# EAGLE schematic MAIN_FM (EAGLE 5.11)

## Sheet 1 of 6
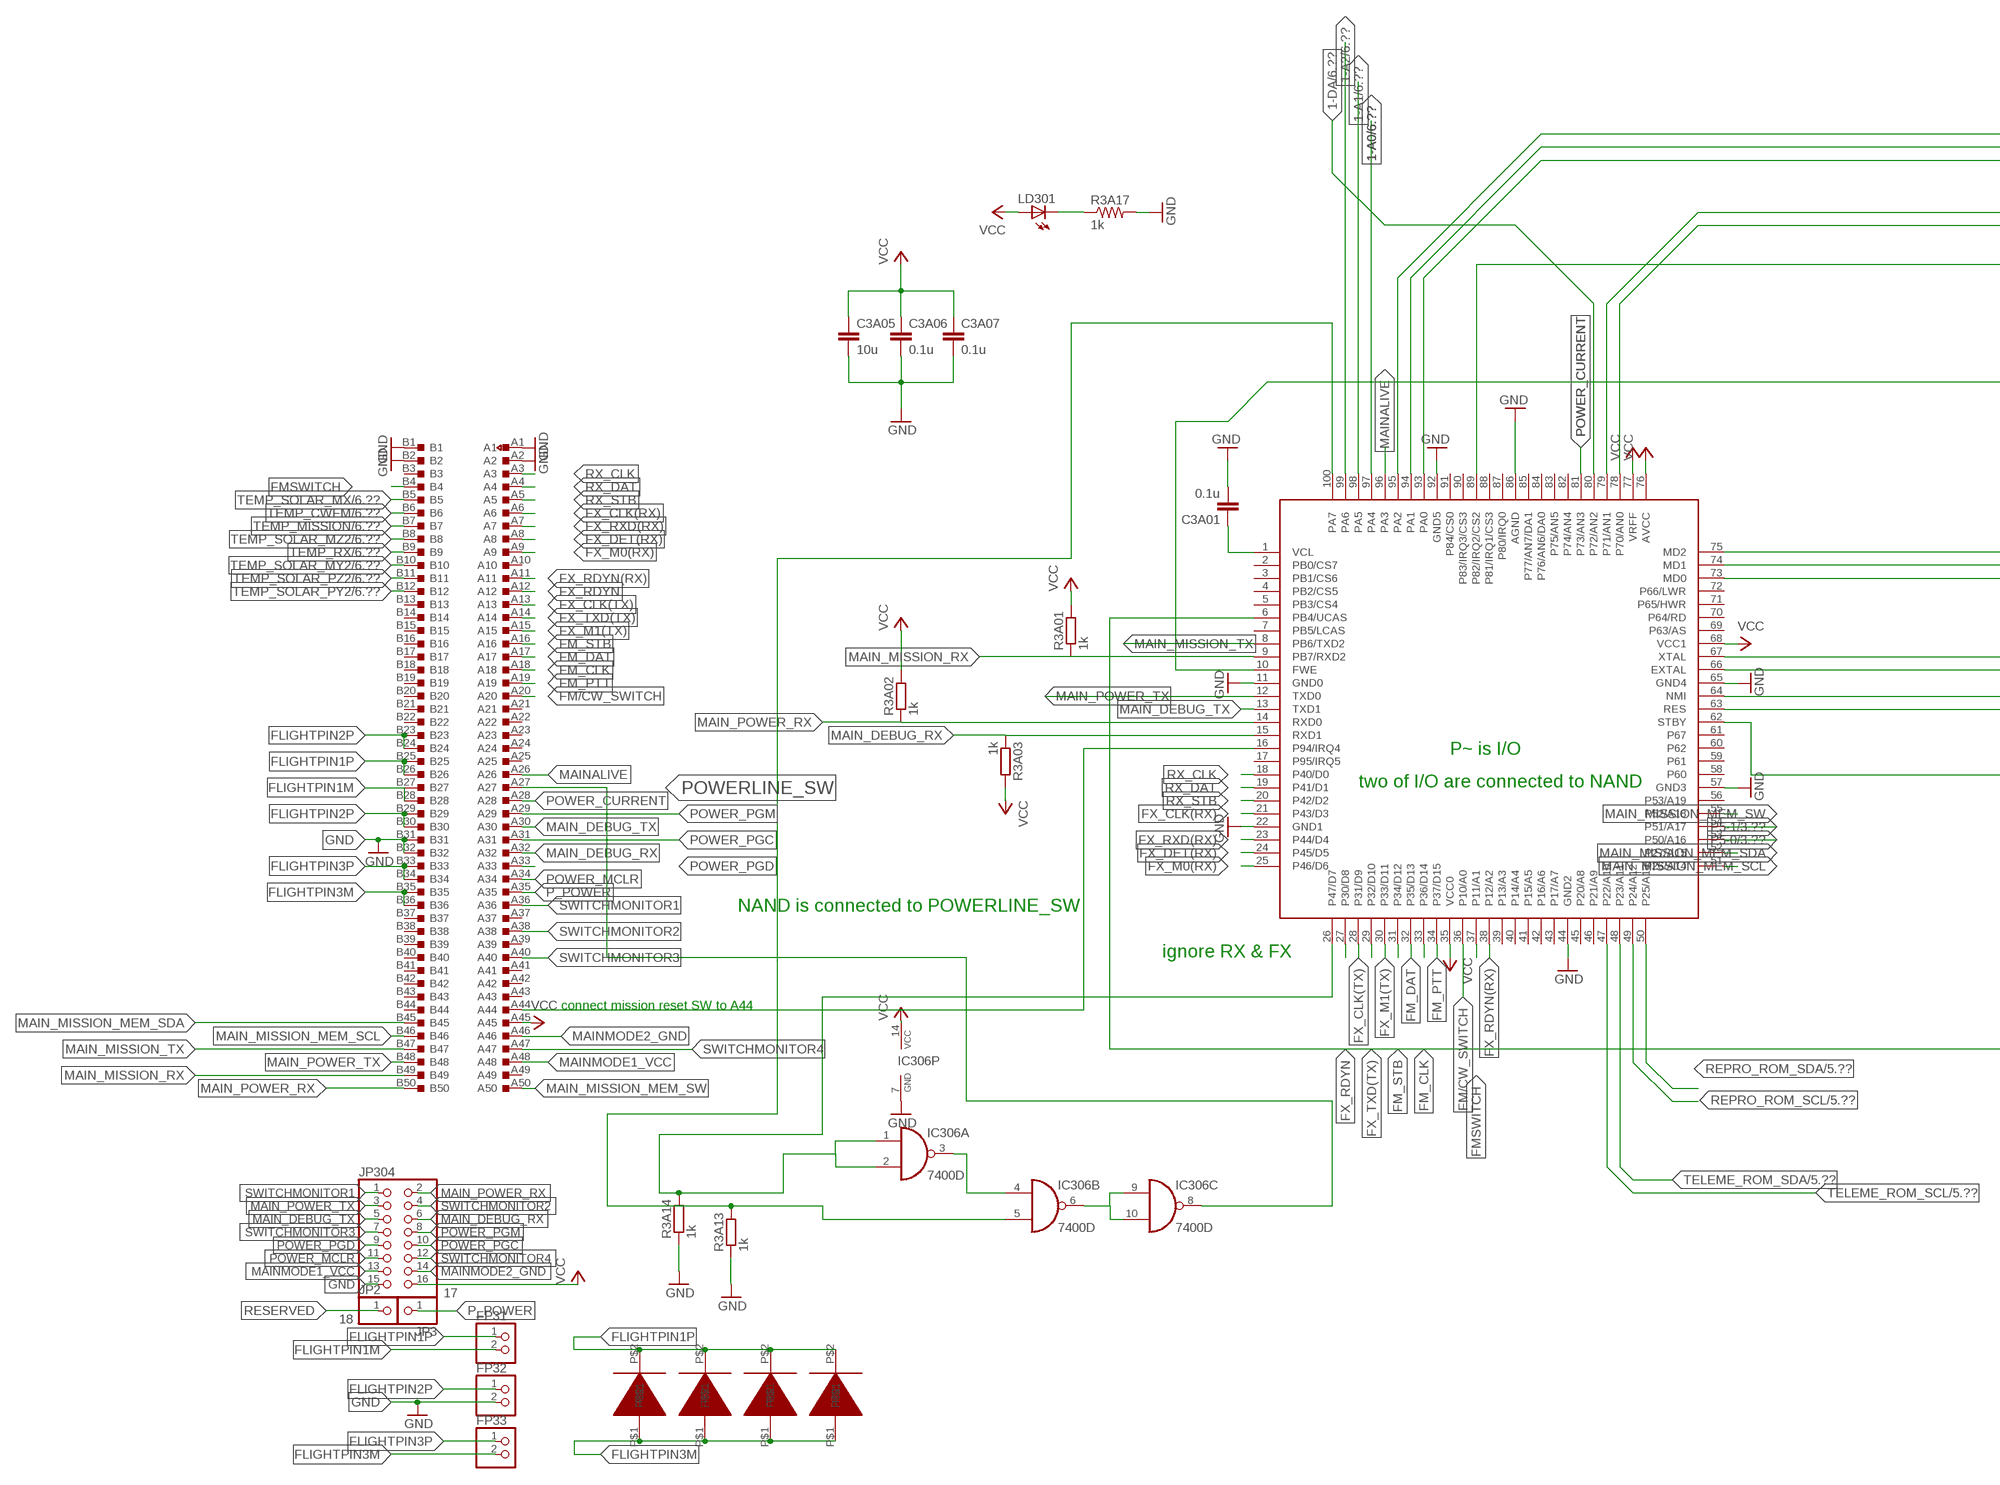
[diagram p0: schematic, sheet 1, part 1 of 2]
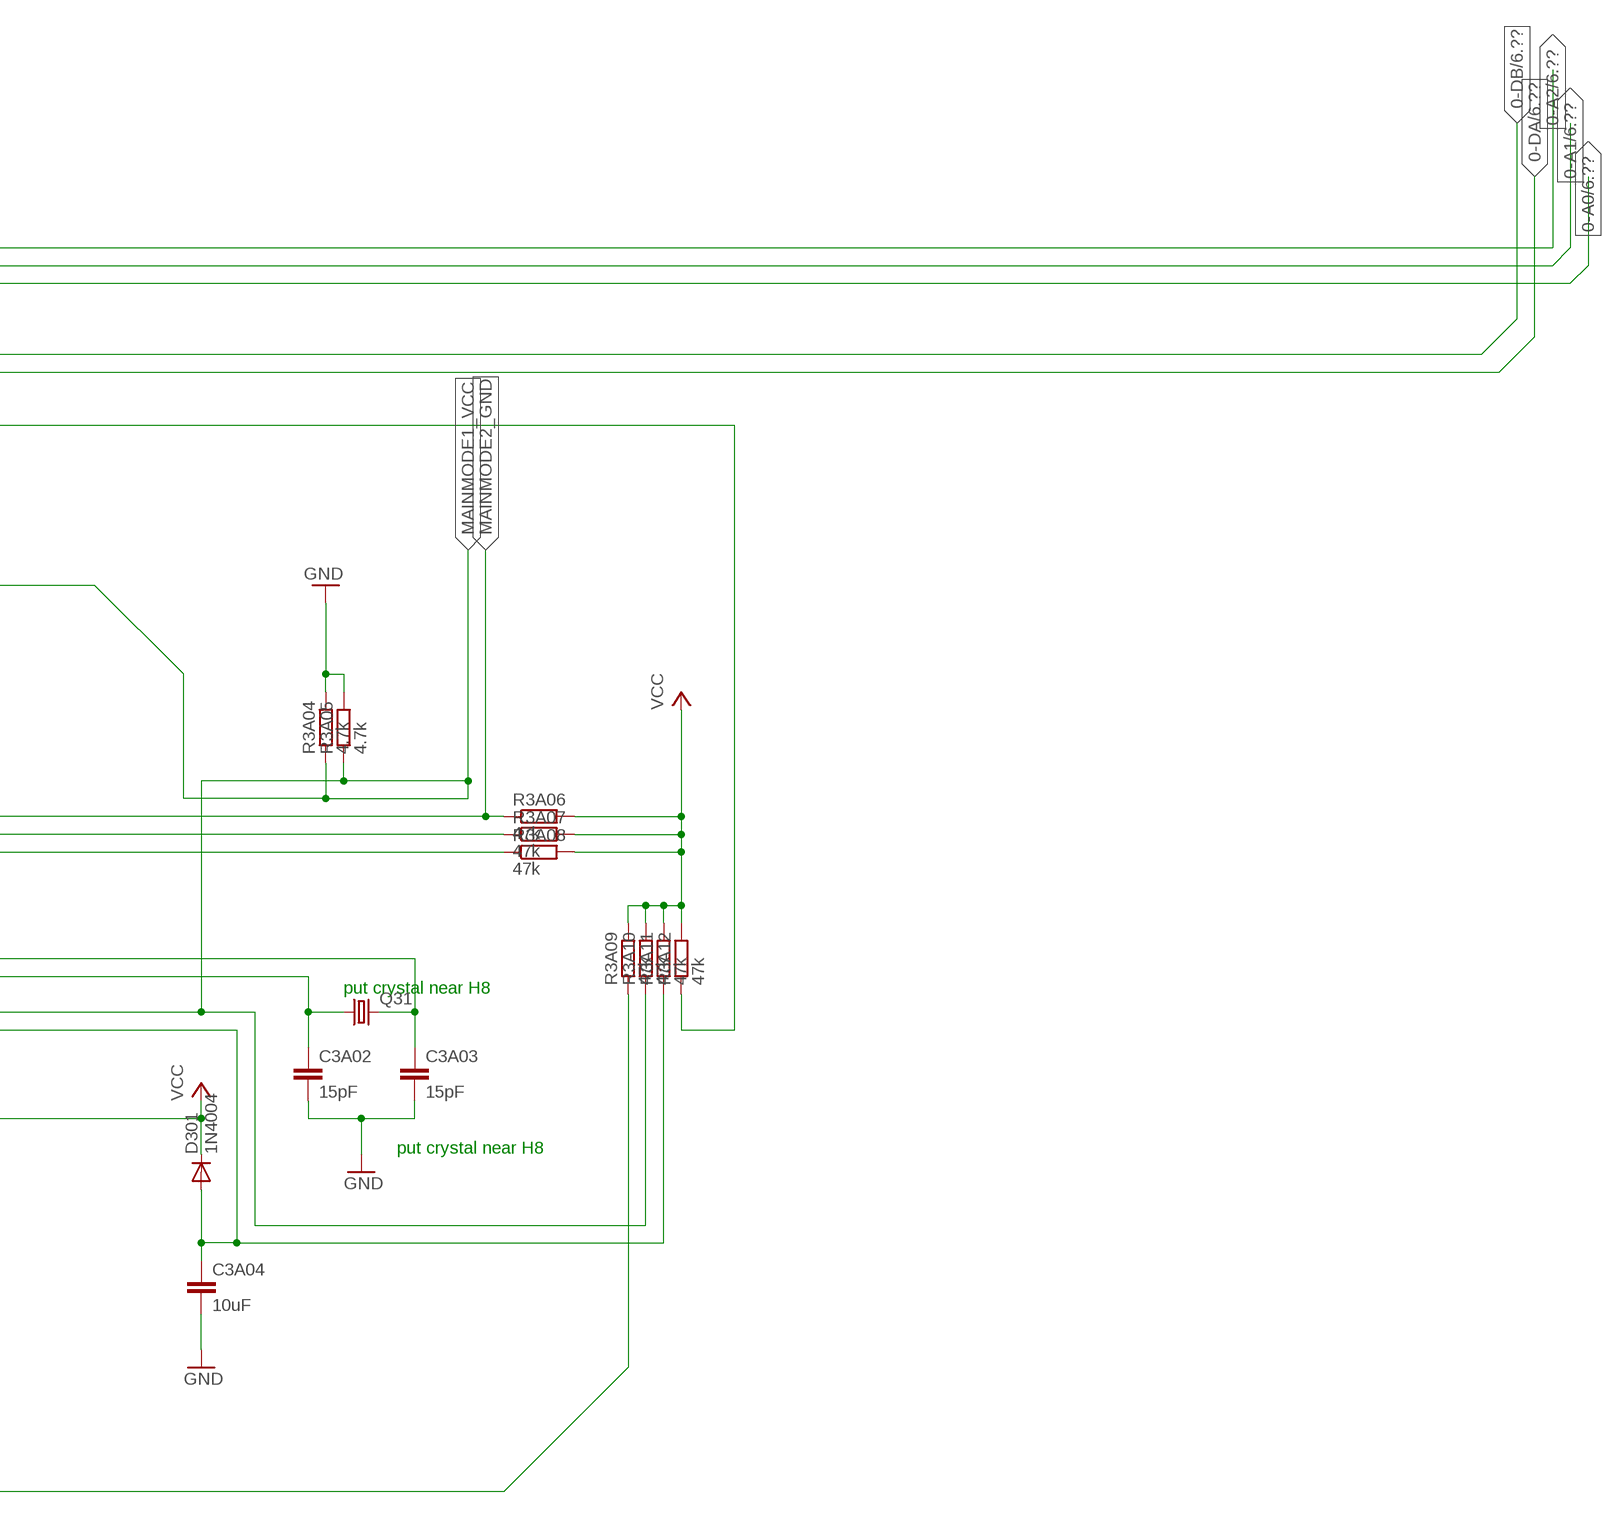
[diagram p1: schematic, sheet 1, part 2 of 2]

### Parts
C3A01  0.1u  C-EUC0603  [C0603]
C3A02  15pF  C-EUC0603  [C0603]
C3A03  15pF  C-EUC0603  [C0603]
C3A04  10uF  C-EUC0603  [C0603]
C3A05  10u  C-EUC0603  [C0603]
C3A06  0.1u  C-EUC0603  [C0603]
C3A07  0.1u  C-EUC0603  [C0603]
D3A01  DIODE_FM  [DIODE_FM]
D3A02  DIODE_FM  [DIODE_FM]
D3A03  DIODE_FM  [DIODE_FM]
D3A04  DIODE_FM  [DIODE_FM]
D301  1N4004  [DO41-10]
FP31  PINHD-1X2  [1X02]
FP32  PINHD-1X2  [1X02]
FP33  PINHD-1X2  [1X02]
H801  H8-3069  [H8-3069]
HCONM  XH3A-0141-A_NEW  [XH3A-0141-A]
IC306  7400D  [SO14]
JP2  PINHD-1X1  [1X01]
JP3  PINHD-1X1  [1X01]
JP304  PINHD-2X8  [2X08]
LD301  LEDCHIPLED_1206  [CHIPLED_1206]
Q31  CRYSTALHC49S  [HC49/S]
R3A01  1k  R-EU_R0603  [R0603]
R3A02  1k  R-EU_R0603  [R0603]
R3A03  1k  R-EU_R0603  [R0603]
R3A04  4.7k  R-EU_R0603  [R0603]
R3A05  4.7k  R-EU_R0603  [R0603]
R3A06  47k  R-EU_R0603  [R0603]
R3A07  47k  R-EU_R0603  [R0603]
R3A08  47k  R-EU_R0603  [R0603]
R3A09  47k  R-EU_R0603  [R0603]
R3A10  47k  R-EU_R0603  [R0603]
R3A11  47k  R-EU_R0603  [R0603]
R3A12  47k  R-EU_R0603  [R0603]
R3A13  1k  R-EU_R0603  [R0603]
R3A14  1k  R-EU_R0603  [R0603]
R3A17  1k  R-US_R0603  [R0603]

### Nets
0-A0: H801.93(PA0) ; also sheet 6
0-A1: H801.94(PA1) ; also sheet 6
0-A2: H801.95(PA2) ; also sheet 6
0-DA: H801.78(P70/AN0) ; also sheet 6
0-DB: H801.79(P71/AN1) ; also sheet 6
1-A0: H801.97(PA4) ; also sheet 6
1-A1: H801.98(PA5) ; also sheet 6
1-A2: H801.99(PA6) ; also sheet 6
1-DA: H801.80(P72/AN2) ; also sheet 6
FLIGHTPIN1M: FP31.2 HCONM.B27 HCONM.B28
FLIGHTPIN1P: D3A01.P$2 D3A02.P$2 D3A03.P$2 D3A04.P$2 FP31.1 HCONM.B25 HCONM.B26
FLIGHTPIN2P: FP32.1 HCONM.B23 HCONM.B24 HCONM.B29 HCONM.B30
FLIGHTPIN3M: D3A01.P$1 D3A02.P$1 D3A03.P$1 D3A04.P$1 FP33.2 HCONM.B35 HCONM.B36
FLIGHTPIN3P: FP33.1 HCONM.B33 HCONM.B34
FM/CW_SWITCH: H801.36(P10/A0) HCONM.A20
FM_CLK: H801.33(P36/D14) HCONM.A18
FM_DAT: H801.32(P35/D13) HCONM.A17
FM_PTT: H801.34(P37/D15) HCONM.A19
FM_STB: H801.31(P34/D12) HCONM.A16
FMSWITCH: H801.37(P11/A1) HCONM.B4
FX_CLK(RX): H801.21(P43/D3) HCONM.A6
FX_CLK(TX): H801.28(P31/D9) HCONM.A13
FX_DET(RX): H801.24(P45/D5) HCONM.A8
FX_M0(RX): H801.25(P46/D6) HCONM.A9
FX_M1(TX): H801.30(P33/D11) HCONM.A15
FX_RDYN: H801.27(P30/D8) HCONM.A12
FX_RDYN(RX): H801.38(P12/A2) HCONM.A11
FX_RXD(RX): H801.23(P44/D4) HCONM.A7
FX_TXD(TX): H801.29(P32/D10) HCONM.A14
GND: C3A01.2 C3A02.2 C3A03.2 C3A04.2 C3A05.2 C3A06.2 C3A07.2 FP32.2 H801.11(GND0) H801.22(GND1) H801.44(GND2) H801.57(GND3) H801.65(GND4) H801.86(AGND) H801.92(GND5) HCONM.A1 HCONM.A2 HCONM.B1 HCONM.B2 HCONM.B31 HCONM.B32 IC306.7(P:GND) JP304.15 R3A04.2 R3A05.2 R3A13.1 R3A14.1 R3A17.2 ; also sheet 2,3,4,5,6
MAIN_DEBUG_RX: H801.15(RXD1) HCONM.A32 JP304.6 R3A03.1
MAIN_DEBUG_TX: H801.13(TXD1) HCONM.A30 JP304.5
MAIN_MISSION_MEM_SCL: H801.51(P26/A14) HCONM.B46
MAIN_MISSION_MEM_SDA: H801.52(P27/A15) HCONM.B45
MAIN_MISSION_MEM_SW: H801.55(P52/A18) HCONM.A50
MAIN_MISSION_RX: H801.9(PB7/RXD2) HCONM.B49 R3A01.1
MAIN_MISSION_TX: H801.8(PB6/TXD2) HCONM.B47
MAIN_POWER_RX: H801.14(RXD0) HCONM.B50 JP304.2 R3A02.1
MAIN_POWER_TX: H801.12(TXD0) HCONM.B48 JP304.3
MAINALIVE: H801.96(PA3) HCONM.A26
MAINMODE1_VCC: H801.10(FWE) H801.64(NMI) HCONM.A48 JP304.13 R3A04.1 R3A05.1 R3A10.1
MAINMODE2_GND: H801.75(MD2) HCONM.A46 JP304.14 R3A06.1
N$4: LD301.C R3A17.1
N$7: C3A03.1 H801.67(XTAL) Q31.2
N$9: C3A04.1 D301.A H801.63(RES) R3A11.1
N$10: C3A01.1 H801.1(VCL)
N$13: H801.6(PB4/UCAS) R3A09.1
N$14: H801.89(P82/IRQ2/CS2) R3A12.1
N$16: IC306.3(A:O) IC306.4(B:I0)
N$19: IC306.6(B:O) IC306.9(C:I0) IC306.10(C:I1)
N$22: C3A02.1 H801.66(EXTAL) Q31.1
N$23: H801.16(P94/IRQ4) HCONM.A44
N$33: H801.26(P47/D7) IC306.1(A:I0) IC306.2(A:I1) R3A14.2
N$34: H801.100(PA7) IC306.5(B:I1) R3A13.2
N$67: H801.74(MD1) R3A07.1
N$68: H801.73(MD0) R3A08.1
P5-0: H801.53(P50/A16) ; also sheet 3
P5-1: H801.54(P51/A17) ; also sheet 3
P_POWER: HCONM.A35 JP3.1
POWER_CURRENT: H801.81(P73/AN3) HCONM.A28
POWER_MCLR: HCONM.A34 JP304.11
POWER_PGC: HCONM.A31 JP304.10
POWER_PGD: HCONM.A33 JP304.9
POWER_PGM: HCONM.A29 JP304.8
POWERLINE_SW: HCONM.A27 IC306.8(C:O)
REPRO_ROM_SCL: H801.49(P24/A12) ; also sheet 5
REPRO_ROM_SDA: H801.50(P25/A13) ; also sheet 5
RESERVED: JP2.1
RX_CLK: H801.18(P40/D0) HCONM.A3
RX_DAT: H801.19(P41/D1) HCONM.A4
RX_STB: H801.20(P42/D2) HCONM.A5
SWITCHMONITOR1: HCONM.A36 JP304.1
SWITCHMONITOR2: HCONM.A38 JP304.4
SWITCHMONITOR3: HCONM.A40 JP304.7
SWITCHMONITOR4: HCONM.A47 JP304.12
TELEME_ROM_SCL: H801.47(P22/A10) ; also sheet 5
TELEME_ROM_SDA: H801.48(P23/A11) ; also sheet 5
TEMP_CWFM: HCONM.B6 ; also sheet 6
TEMP_MISSION: HCONM.B7 ; also sheet 6
TEMP_RX: HCONM.B9 ; also sheet 6
TEMP_SOLAR_MX: HCONM.B5 ; also sheet 6
TEMP_SOLAR_MY2: HCONM.B10 ; also sheet 6
TEMP_SOLAR_MZ2: HCONM.B8 ; also sheet 6
TEMP_SOLAR_PY2: HCONM.B12 ; also sheet 6
TEMP_SOLAR_PZ2: HCONM.B11 ; also sheet 6
VCC: C3A05.1 C3A06.1 C3A07.1 D301.C H801.35(VCC0) H801.62(STBY) H801.68(VCC1) H801.76(AVCC) H801.77(VRFF) HCONM.A45 IC306.14(P:VCC) JP304.16 LD301.A R3A01.2 R3A02.2 R3A03.2 R3A06.2 R3A07.2 R3A08.2 R3A09.2 R3A10.2 R3A11.2 R3A12.2 ; also sheet 2,3,4,5,6
Unconnected: H801.2(PB0/CS7) H801.3(PB1/CS6) H801.4(PB2/CS5) H801.5(PB3/CS4) H801.7(PB5/LCAS) H801.17(P95/IRQ5) H801.39(P13/A3) H801.40(P14/A4) H801.41(P15/A5) H801.42(P16/A6) H801.43(P17/A7) H801.45(P20/A8) H801.46(P21/A9) H801.56(P53/A19) H801.58(P60) H801.59(P61) H801.60(P62) H801.61(P67) H801.69(P63/AS) H801.70(P64/RD) H801.71(P65/HWR) H801.72(P66/LWR) H801.82(P74/AN4) H801.83(P75/AN5) H801.84(P76/AN6/DA0) H801.85(P77/AN7/DA1) H801.87(P80/IRQ0) H801.88(P81/IRQ1/CS3) H801.90(P83/IRQ3/CS3) H801.91(P84/CS0) HCONM.A10 HCONM.A21 HCONM.A22 HCONM.A23 HCONM.A24 HCONM.A25 HCONM.A37 HCONM.A39 HCONM.A41 HCONM.A42 HCONM.A43 HCONM.A49 HCONM.B3 HCONM.B13 HCONM.B14 HCONM.B15 HCONM.B16 HCONM.B17 HCONM.B18 HCONM.B19 HCONM.B20 HCONM.B21 HCONM.B22 HCONM.B37 HCONM.B38 HCONM.B39 HCONM.B40 HCONM.B41 HCONM.B42 HCONM.B43 HCONM.B44 IC306.11(D:O) IC306.12(D:I0) IC306.13(D:I1)

### Notes on the sheet
- put crystal near H8
- P~ is I/O
- two of I/O are connected to NAND
- put crystal near H8
- NAND is connected to POWERLINE_SW
- ignore RX & FX
- connect mission reset SW to A44
- 17
- 18

## Sheet 2 of 6
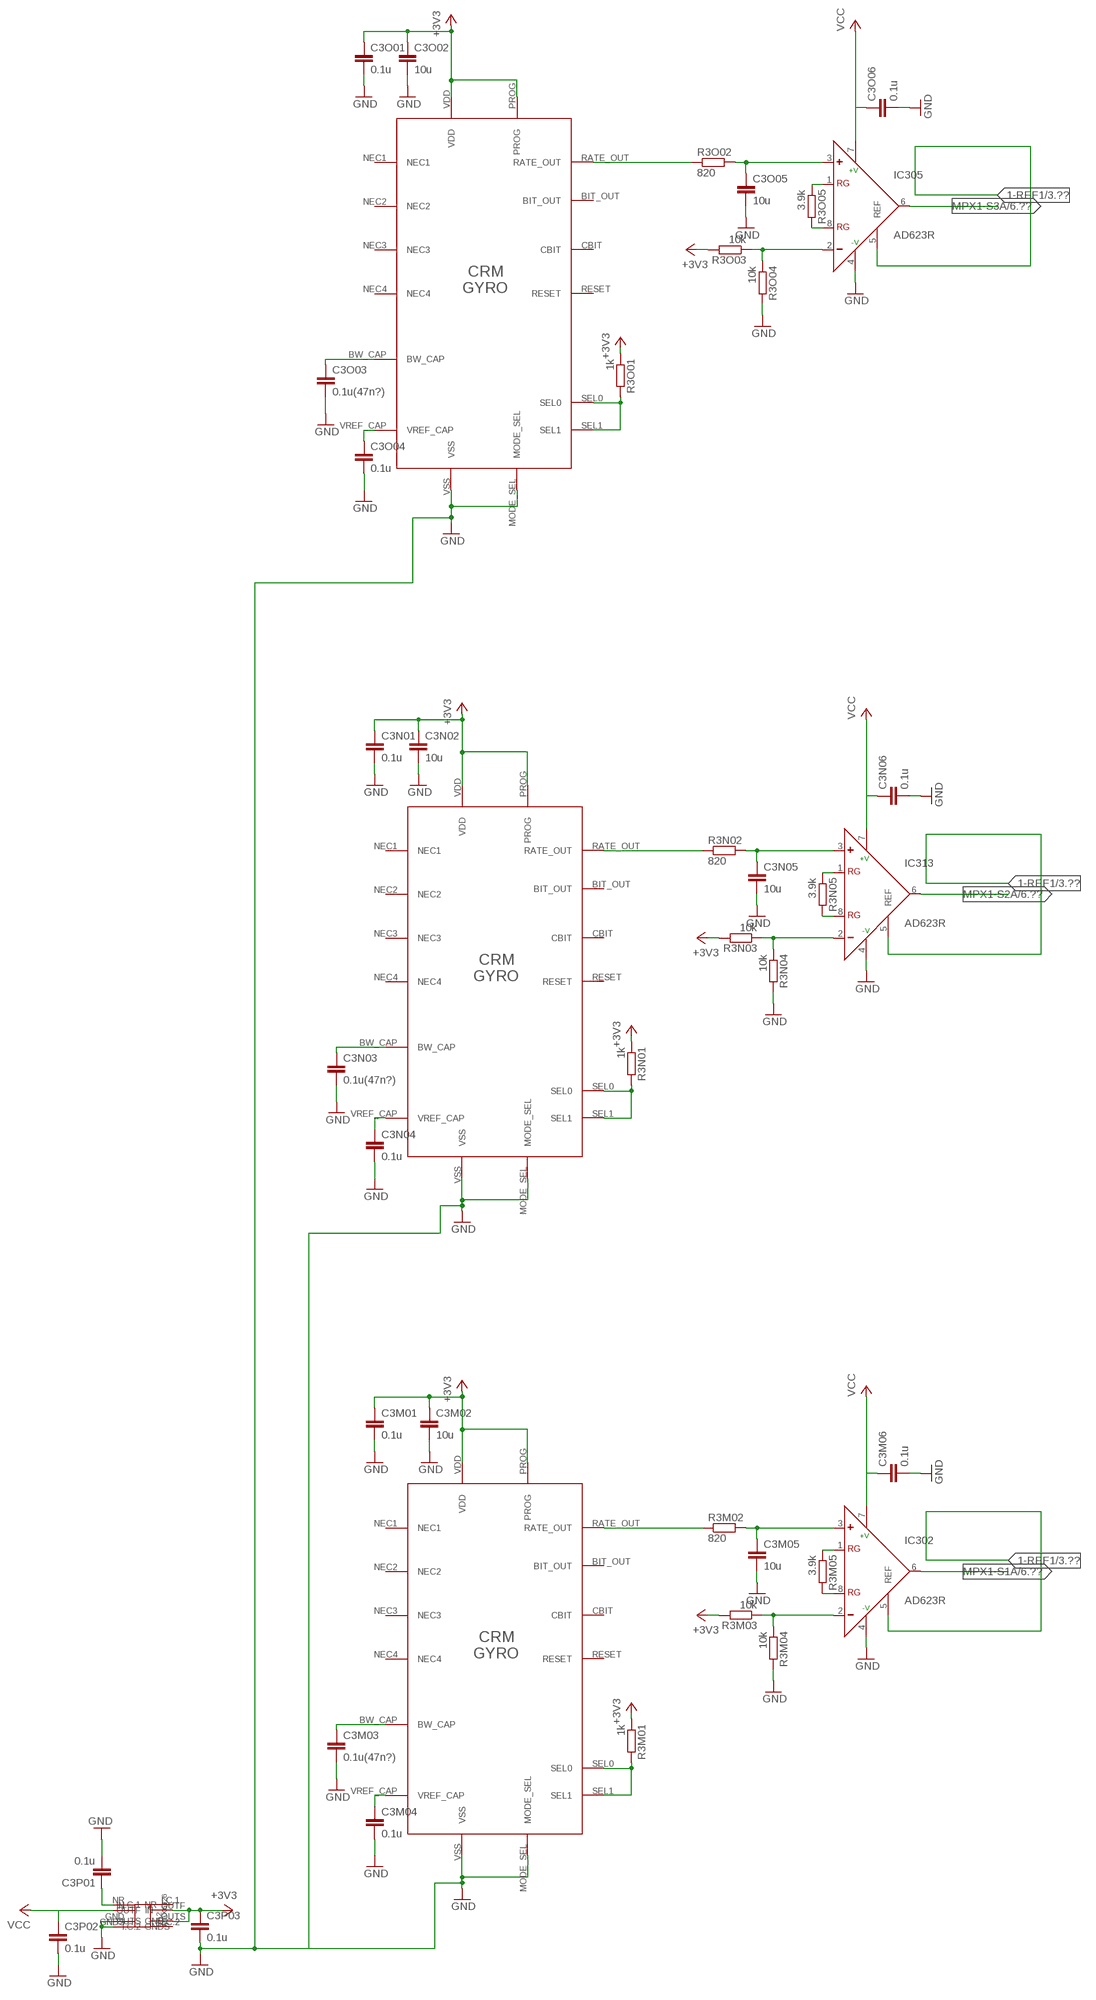
[diagram p2: schematic, sheet 2]

### Parts
C3M01  0.1u  C-EUC0603  [C0603]
C3M02  10u  C-EUC0603  [C0603]
C3M03  0.1u(47n?)  C-EUC0603  [C0603]
C3M04  0.1u  C-EUC0603  [C0603]
C3M05  10u  C-EUC0603  [C0603]
C3M06  0.1u  C-EUC0603  [C0603]
C3N01  0.1u  C-EUC0603  [C0603]
C3N02  10u  C-EUC0603  [C0603]
C3N03  0.1u(47n?)  C-EUC0603  [C0603]
C3N04  0.1u  C-EUC0603  [C0603]
C3N05  10u  C-EUC0603  [C0603]
C3N06  0.1u  C-EUC0603  [C0603]
C3O01  0.1u  C-EUC0603  [C0603]
C3O02  10u  C-EUC0603  [C0603]
C3O03  0.1u(47n?)  C-EUC0603  [C0603]
C3O04  0.1u  C-EUC0603  [C0603]
C3O05  10u  C-EUC0603  [C0603]
C3O06  0.1u  C-EUC0603  [C0603]
C3P01  0.1u  C-EUC0603  [C0603]
C3P02  0.1u  C-EUC0603  [C0603]
C3P03  0.1u  C-EUC0603  [C0603]
G301  CRM200  [CRM200]
G302  CRM200  [CRM200]
G303  CRM100  [CRM100]
IC302  AD623R  [SO8]
IC305  AD623R  [SO8]
IC313  AD623R  [SO8]
R3M01  1k  R-EU_R0603  [R0603]
R3M02  820  R-EU_R0603  [R0603]
R3M03  10k  R-EU_R0603  [R0603]
R3M04  10k  R-EU_R0603  [R0603]
R3M05  3.9k  R-EU_R0603  [R0603]
R3N01  1k  R-EU_R0603  [R0603]
R3N02  820  R-EU_R0603  [R0603]
R3N03  10k  R-EU_R0603  [R0603]
R3N04  10k  R-EU_R0603  [R0603]
R3N05  3.9k  R-EU_R0603  [R0603]
R3O01  1k  R-EU_R0603  [R0603]
R3O02  820  R-EU_R0603  [R0603]
R3O03  10k  R-EU_R0603  [R0603]
R3O04  10k  R-EU_R0603  [R0603]
R3O05  3.9k  R-EU_R0603  [R0603]
UA2  MAX6126  [MAX6126]

### Nets
1-REF1: IC302.5(REF) IC305.5(REF) IC313.5(REF) ; also sheet 3
+3V3: C3M01.1 C3M02.1 C3N01.1 C3N02.1 C3O01.1 C3O02.1 C3P03.1 G301.PROG G301.VDD G302.PROG G302.VDD G303.PROG G303.VDD R3M01.1 R3M03.2 R3N01.1 R3N03.2 R3O01.1 R3O03.2 UA2.OUTF UA2.OUTS ; also sheet 3
GND: C3M01.2 C3M02.2 C3M03.2 C3M04.2 C3M05.2 C3M06.2 C3N01.2 C3N02.2 C3N03.2 C3N04.2 C3N05.2 C3N06.2 C3O01.2 C3O02.2 C3O03.2 C3O04.2 C3O05.2 C3O06.2 C3P01.2 C3P02.2 C3P03.2 G301.MODE_SEL G301.VSS G302.MODE_SEL G302.VSS G303.MODE_SEL G303.VSS IC302.4(-V) IC305.4(-V) IC313.4(-V) R3M04.2 R3N04.2 R3O04.2 UA2.GND UA2.GNDS ; also sheet 1,3,4,5,6
MPX1-S1A: IC302.6(OUT) ; also sheet 6
MPX1-S2A: IC313.6(OUT) ; also sheet 6
MPX1-S3A: IC305.6(OUT) ; also sheet 6
N$1: C3P01.1 UA2.NR
N$2: C3M04.1 G301.VREF_CAP
N$3: C3M03.1 G301.BW_CAP
N$5: G301.RATE_OUT R3M02.1
N$6: C3M05.1 IC302.3(+) R3M02.2
N$8: IC302.2(-) R3M03.1 R3M04.1
N$11: IC302.8(RG) R3M05.2
N$12: IC302.1(RG) R3M05.1
N$21: G301.SEL0 G301.SEL1 R3M01.2
N$24: C3N04.1 G302.VREF_CAP
N$27: C3N03.1 G302.BW_CAP
N$28: G302.RATE_OUT R3N02.1
N$29: C3N05.1 IC313.3(+) R3N02.2
N$30: IC313.2(-) R3N03.1 R3N04.1
N$31: IC313.8(RG) R3N05.2
N$32: IC313.1(RG) R3N05.1
N$38: G302.SEL0 G302.SEL1 R3N01.2
N$41: IC305.2(-) R3O03.1 R3O04.1
N$47: IC305.8(RG) R3O05.2
N$48: IC305.1(RG) R3O05.1
N$52: G303.RATE_OUT R3O02.1
N$54: C3O05.1 IC305.3(+) R3O02.2
N$55: C3O03.1 G303.BW_CAP
N$56: C3O04.1 G303.VREF_CAP
N$62: G303.SEL0 G303.SEL1 R3O01.2
VCC: C3M06.1 C3N06.1 C3O06.1 C3P02.1 IC302.7(+V) IC305.7(+V) IC313.7(+V) UA2.IN ; also sheet 1,3,4,5,6
Unconnected: G301.BIT_OUT G301.CBIT G301.NEC1 G301.NEC2 G301.NEC3 G301.NEC4 G301.RESET G302.BIT_OUT G302.CBIT G302.NEC1 G302.NEC2 G302.NEC3 G302.NEC4 G302.RESET G303.BIT_OUT G303.CBIT G303.NEC1 G303.NEC2 G303.NEC3 G303.NEC4 G303.RESET UA2.I.C.1 UA2.I.C.2

## Sheet 3 of 6
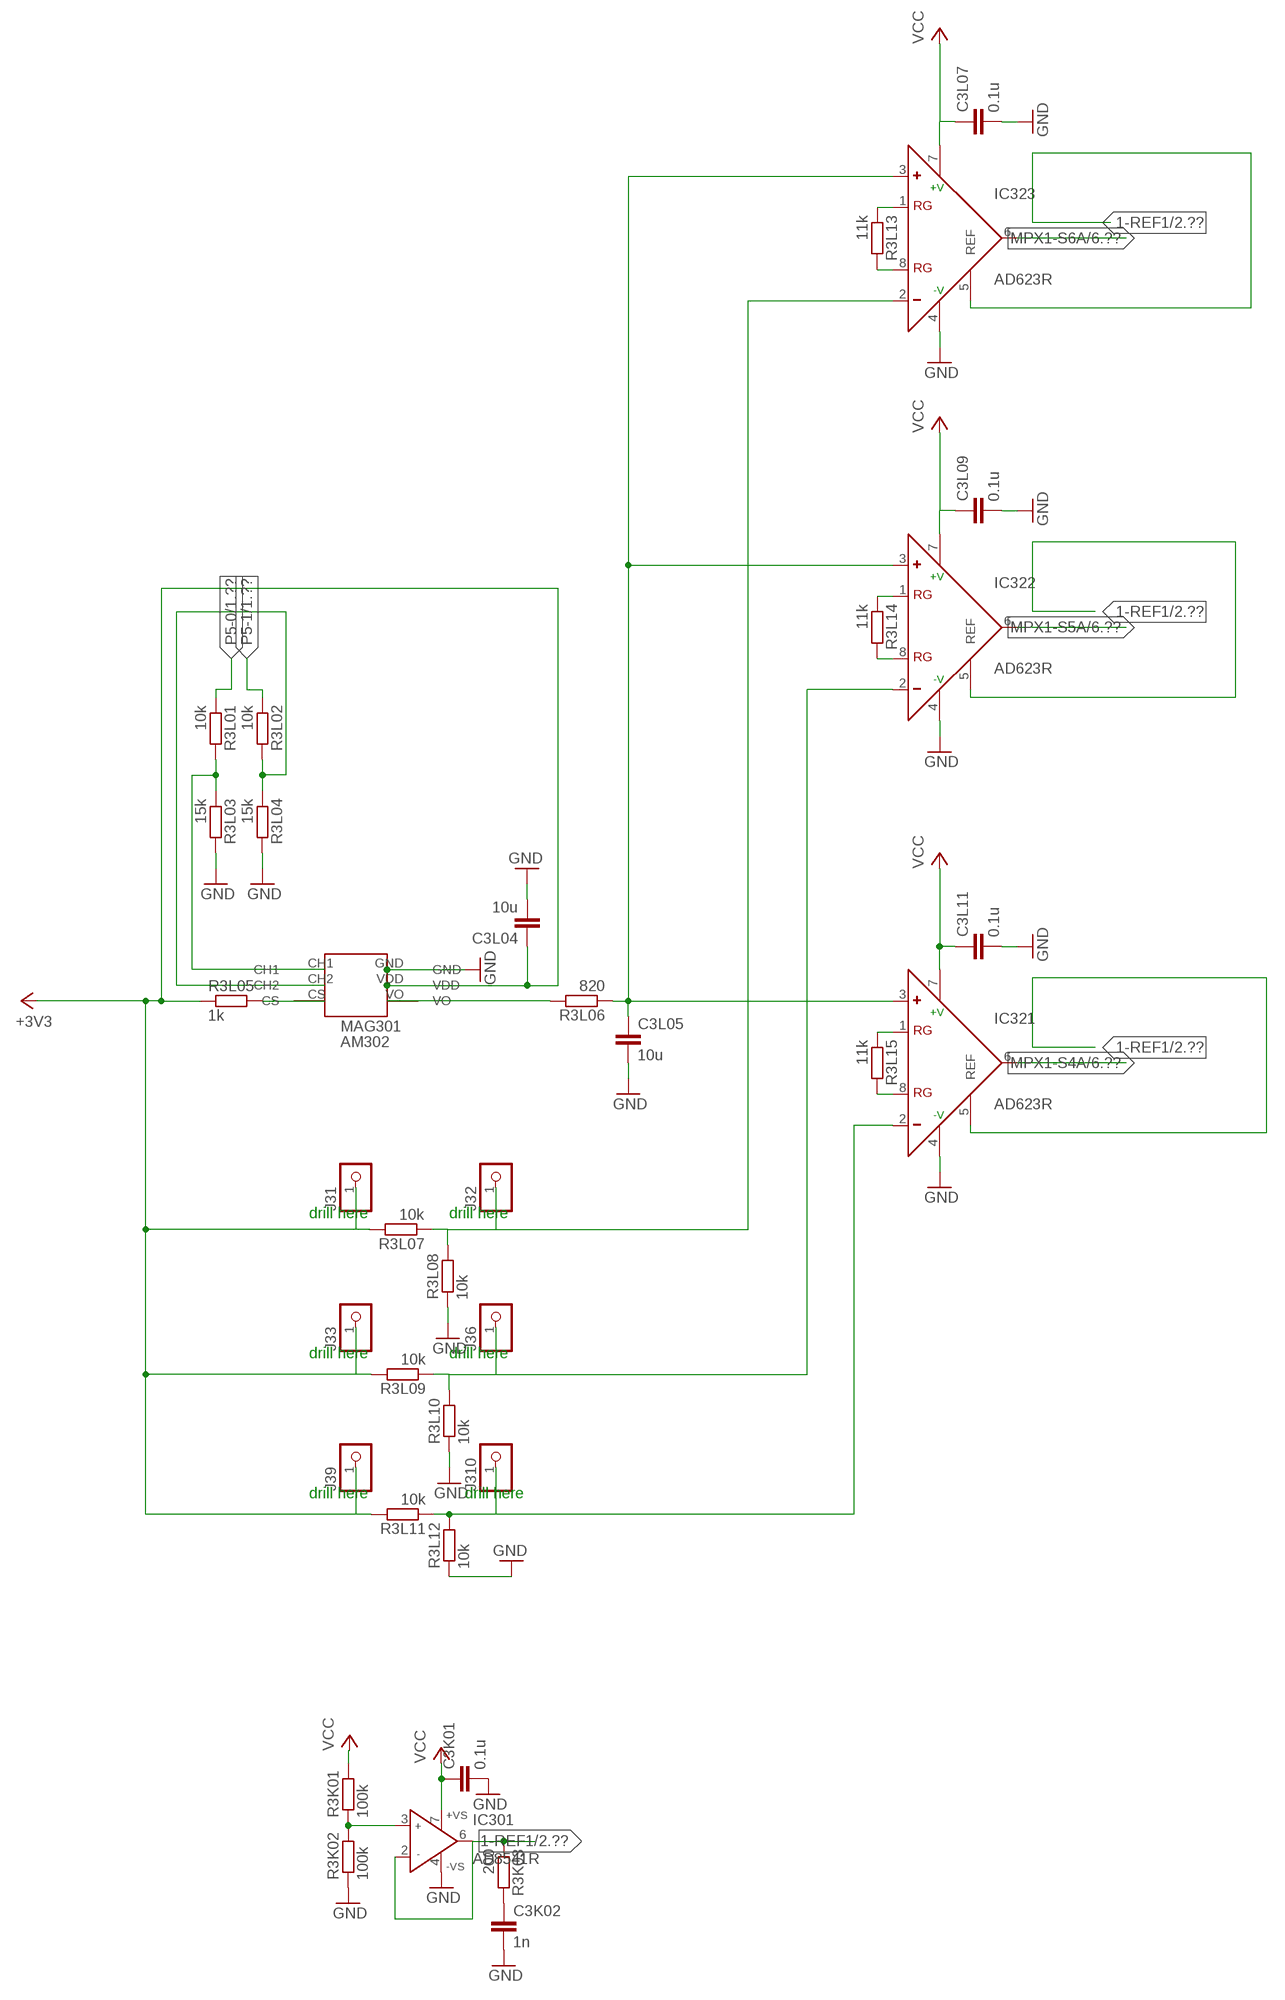
[diagram p3: schematic, sheet 3]

### Parts
C3K01  0.1u  C-EUC0603  [C0603]
C3K02  1n  C-EUC0603  [C0603]
C3L04  10u  C-EUC0603  [C0603]
C3L05  10u  C-EUC0603  [C0603]
C3L07  0.1u  C-EUC0603  [C0603]
C3L09  0.1u  C-EUC0603  [C0603]
C3L11  0.1u  C-EUC0603  [C0603]
IC301  AD8541R  [SO8]
IC321  AD623R  [SO8]
IC322  AD623R  [SO8]
IC323  AD623R  [SO8]
J31  PINHD-1X1  [1X01]
J32  PINHD-1X1  [1X01]
J33  PINHD-1X1  [1X01]
J36  PINHD-1X1  [1X01]
J39  PINHD-1X1  [1X01]
J310  PINHD-1X1  [1X01]
MAG301  AM302  [AMI302]
R3K01  100k  R-EU_R0603  [R0603]
R3K02  100k  R-EU_R0603  [R0603]
R3K03  200  R-EU_R0603  [R0603]
R3L01  10k  R-EU_R0603  [R0603]
R3L02  10k  R-EU_R0603  [R0603]
R3L03  15k  R-EU_R0603  [R0603]
R3L04  15k  R-EU_R0603  [R0603]
R3L05  1k  R-EU_R0603  [R0603]
R3L06  820  R-EU_R0603  [R0603]
R3L07  10k  R-EU_R0603  [R0603]
R3L08  10k  R-EU_R0603  [R0603]
R3L09  10k  R-EU_R0603  [R0603]
R3L10  10k  R-EU_R0603  [R0603]
R3L11  10k  R-EU_R0603  [R0603]
R3L12  10k  R-EU_R0603  [R0603]
R3L13  11k  R-EU_R0603  [R0603]
R3L14  11k  R-EU_R0603  [R0603]
R3L15  11k  R-EU_R0603  [R0603]

### Nets
1-REF1: IC301.2(IN-) IC301.6(OUT) IC321.5(REF) IC322.5(REF) IC323.5(REF) R3K03.1 ; also sheet 2
+3V3: C3L04.1 J31.1 J33.1 J39.1 MAG301.VDD R3L05.1 R3L07.2 R3L09.2 R3L11.2 ; also sheet 2
GND: C3K01.2 C3K02.2 C3L04.2 C3L05.2 C3L07.2 C3L09.2 C3L11.2 IC301.4(-VS) IC321.4(-V) IC322.4(-V) IC323.4(-V) MAG301.GND R3K02.1 R3L03.2 R3L04.2 R3L08.1 R3L10.1 R3L12.1 ; also sheet 1,2,4,5,6
MPX1-S4A: IC321.6(OUT) ; also sheet 6
MPX1-S5A: IC322.6(OUT) ; also sheet 6
MPX1-S6A: IC323.6(OUT) ; also sheet 6
N$18: MAG301.CS R3L05.2
N$69: IC301.3(IN+) R3K01.1 R3K02.2
N$71: C3K02.1 R3K03.2
N$159: IC321.1(RG) R3L15.1
N$160: IC321.8(RG) R3L15.2
N$163: IC321.2(-) J310.1 R3L11.1 R3L12.2
N$166: MAG301.CH1 R3L01.2 R3L03.1
N$167: MAG301.VO R3L06.2
N$168: MAG301.CH2 R3L02.2 R3L04.1
N$170: IC322.2(-) J36.1 R3L09.1 R3L10.2
N$171: IC322.1(RG) R3L14.1
N$172: IC322.8(RG) R3L14.2
N$175: IC323.2(-) J32.1 R3L07.1 R3L08.2
N$176: C3L05.1 IC321.3(+) IC322.3(+) IC323.3(+) R3L06.1
N$177: IC323.1(RG) R3L13.1
N$178: IC323.8(RG) R3L13.2
P5-0: R3L01.1 ; also sheet 1
P5-1: R3L02.1 ; also sheet 1
VCC: C3K01.1 C3L07.1 C3L09.1 C3L11.1 IC301.7(+VS) IC321.7(+V) IC322.7(+V) IC323.7(+V) R3K01.2 ; also sheet 1,2,4,5,6

### Notes on the sheet
- drill here | drill here
- drill here | drill here
- drill here | drill here

## Sheet 4 of 6
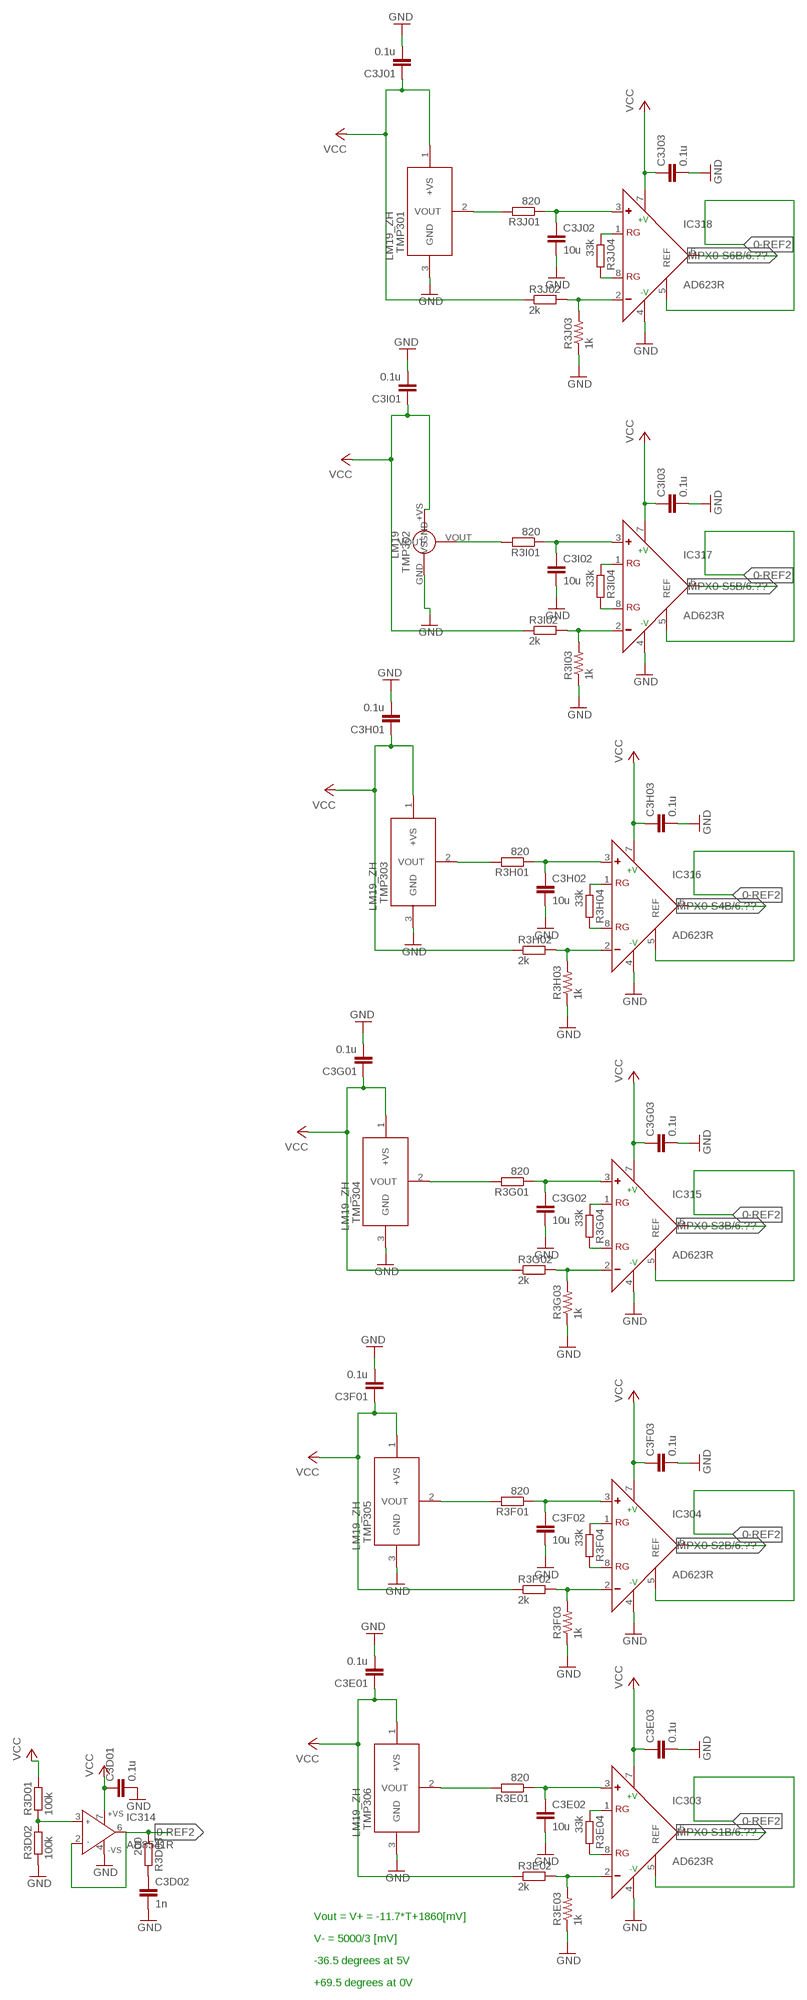
[diagram p4: schematic, sheet 4]

### Parts
C3D01  0.1u  C-EUC0603  [C0603]
C3D02  1n  C-EUC0603  [C0603]
C3E01  0.1u  C-EUC0603  [C0603]
C3E02  10u  C-EUC0603  [C0603]
C3E03  0.1u  C-EUC0603  [C0603]
C3F01  0.1u  C-EUC0603  [C0603]
C3F02  10u  C-EUC0603  [C0603]
C3F03  0.1u  C-EUC0603  [C0603]
C3G01  0.1u  C-EUC0603  [C0603]
C3G02  10u  C-EUC0603  [C0603]
C3G03  0.1u  C-EUC0603  [C0603]
C3H01  0.1u  C-EUC0603  [C0603]
C3H02  10u  C-EUC0603  [C0603]
C3H03  0.1u  C-EUC0603  [C0603]
C3I01  0.1u  C-EUC0603  [C0603]
C3I02  10u  C-EUC0603  [C0603]
C3I03  0.1u  C-EUC0603  [C0603]
C3J01  0.1u  C-EUC0603  [C0603]
C3J02  10u  C-EUC0603  [C0603]
C3J03  0.1u  C-EUC0603  [C0603]
IC303  AD623R  [SO8]
IC304  AD623R  [SO8]
IC314  AD8541R  [SO8]
IC315  AD623R  [SO8]
IC316  AD623R  [SO8]
IC317  AD623R  [SO8]
IC318  AD623R  [SO8]
R3D01  100k  R-EU_R0603  [R0603]
R3D02  100k  R-EU_R0603  [R0603]
R3D03  200  R-EU_R0603  [R0603]
R3E01  820  R-EU_R0603  [R0603]
R3E02  2k  R-EU_R0603  [R0603]
R3E03  1k  R-US_R0603  [R0603]
R3E04  33k  R-EU_R0603  [R0603]
R3F01  820  R-EU_R0603  [R0603]
R3F02  2k  R-EU_R0603  [R0603]
R3F03  1k  R-US_R0603  [R0603]
R3F04  33k  R-EU_R0603  [R0603]
R3G01  820  R-EU_R0603  [R0603]
R3G02  2k  R-EU_R0603  [R0603]
R3G03  1k  R-US_R0603  [R0603]
R3G04  33k  R-EU_R0603  [R0603]
R3H01  820  R-EU_R0603  [R0603]
R3H02  2k  R-EU_R0603  [R0603]
R3H03  1k  R-US_R0603  [R0603]
R3H04  33k  R-EU_R0603  [R0603]
R3I01  820  R-EU_R0603  [R0603]
R3I02  2k  R-EU_R0603  [R0603]
R3I03  1k  R-US_R0603  [R0603]
R3I04  33k  R-EU_R0603  [R0603]
R3J01  820  R-EU_R0603  [R0603]
R3J02  2k  R-EU_R0603  [R0603]
R3J03  1k  R-US_R0603  [R0603]
R3J04  33k  R-EU_R0603  [R0603]
TMP301  LM19_ZH  [LM19_XH]
TMP302  LM19  [LM19]
TMP303  LM19_ZH  [LM19_XH]
TMP304  LM19_ZH  [LM19_XH]
TMP305  LM19_ZH  [LM19_XH]
TMP306  LM19_ZH  [LM19_XH]

### Nets
0-REF2: IC303.5(REF) IC304.5(REF) IC314.2(IN-) IC314.6(OUT) IC315.5(REF) IC316.5(REF) IC317.5(REF) IC318.5(REF) R3D03.1
GND: C3D01.2 C3D02.2 C3E01.2 C3E02.2 C3E03.2 C3F01.2 C3F02.2 C3F03.2 C3G01.2 C3G02.2 C3G03.2 C3H01.2 C3H02.2 C3H03.2 C3I01.2 C3I02.2 C3I03.2 C3J01.2 C3J02.2 C3J03.2 IC303.4(-V) IC304.4(-V) IC314.4(-VS) IC315.4(-V) IC316.4(-V) IC317.4(-V) IC318.4(-V) R3D02.1 R3E03.1 R3F03.1 R3G03.1 R3H03.1 R3I03.1 R3J03.1 TMP301.3(GND) TMP302.GND TMP303.3(GND) TMP304.3(GND) TMP305.3(GND) TMP306.3(GND) ; also sheet 1,2,3,5,6
MPX0-S1B: IC303.6(OUT) ; also sheet 6
MPX0-S2B: IC304.6(OUT) ; also sheet 6
MPX0-S3B: IC315.6(OUT) ; also sheet 6
MPX0-S4B: IC316.6(OUT) ; also sheet 6
MPX0-S5B: IC317.6(OUT) ; also sheet 6
MPX0-S6B: IC318.6(OUT) ; also sheet 6
N$15: R3J01.2 TMP301.2(VOUT)
N$17: R3I01.2 TMP302.VOUT
N$20: R3H01.2 TMP303.2(VOUT)
N$25: R3G01.2 TMP304.2(VOUT)
N$26: R3F01.2 TMP305.2(VOUT)
N$35: R3E01.2 TMP306.2(VOUT)
N$43: IC303.1(RG) R3E04.1
N$53: IC303.8(RG) R3E04.2
N$59: C3E02.1 IC303.3(+) R3E01.1
N$90: IC314.3(IN+) R3D01.1 R3D02.2
N$92: C3D02.1 R3D03.2
N$94: IC303.2(-) R3E02.2 R3E03.2
N$95: IC304.1(RG) R3F04.1
N$96: IC304.8(RG) R3F04.2
N$97: C3F02.1 IC304.3(+) R3F01.1
N$99: IC304.2(-) R3F02.2 R3F03.2
N$100: IC315.1(RG) R3G04.1
N$101: IC315.8(RG) R3G04.2
N$102: C3G02.1 IC315.3(+) R3G01.1
N$104: IC315.2(-) R3G02.2 R3G03.2
N$105: IC316.1(RG) R3H04.1
N$106: IC316.8(RG) R3H04.2
N$107: C3H02.1 IC316.3(+) R3H01.1
N$111: IC316.2(-) R3H02.2 R3H03.2
N$117: IC317.1(RG) R3I04.1
N$123: IC317.8(RG) R3I04.2
N$129: C3I02.1 IC317.3(+) R3I01.1
N$136: IC317.2(-) R3I02.2 R3I03.2
N$137: IC318.1(RG) R3J04.1
N$138: IC318.8(RG) R3J04.2
N$139: C3J02.1 IC318.3(+) R3J01.1
N$141: IC318.2(-) R3J02.2 R3J03.2
VCC: C3D01.1 C3E01.1 C3E03.1 C3F01.1 C3F03.1 C3G01.1 C3G03.1 C3H01.1 C3H03.1 C3I01.1 C3I03.1 C3J01.1 C3J03.1 IC303.7(+V) IC304.7(+V) IC314.7(+VS) IC315.7(+V) IC316.7(+V) IC317.7(+V) IC318.7(+V) R3D01.2 R3E02.1 R3F02.1 R3G02.1 R3H02.1 R3I02.1 R3J02.1 TMP301.1(+VS) TMP302.+VS(VS) TMP303.1(+VS) TMP304.1(+VS) TMP305.1(+VS) TMP306.1(+VS) ; also sheet 1,2,3,5,6

### Notes on the sheet
- Vout = V+ = -11.7*T+1860[mV]
- V- = 5000/3 [mV]
- -36.5 degrees at 5V
- +69.5 degrees at 0V

## Sheet 5 of 6
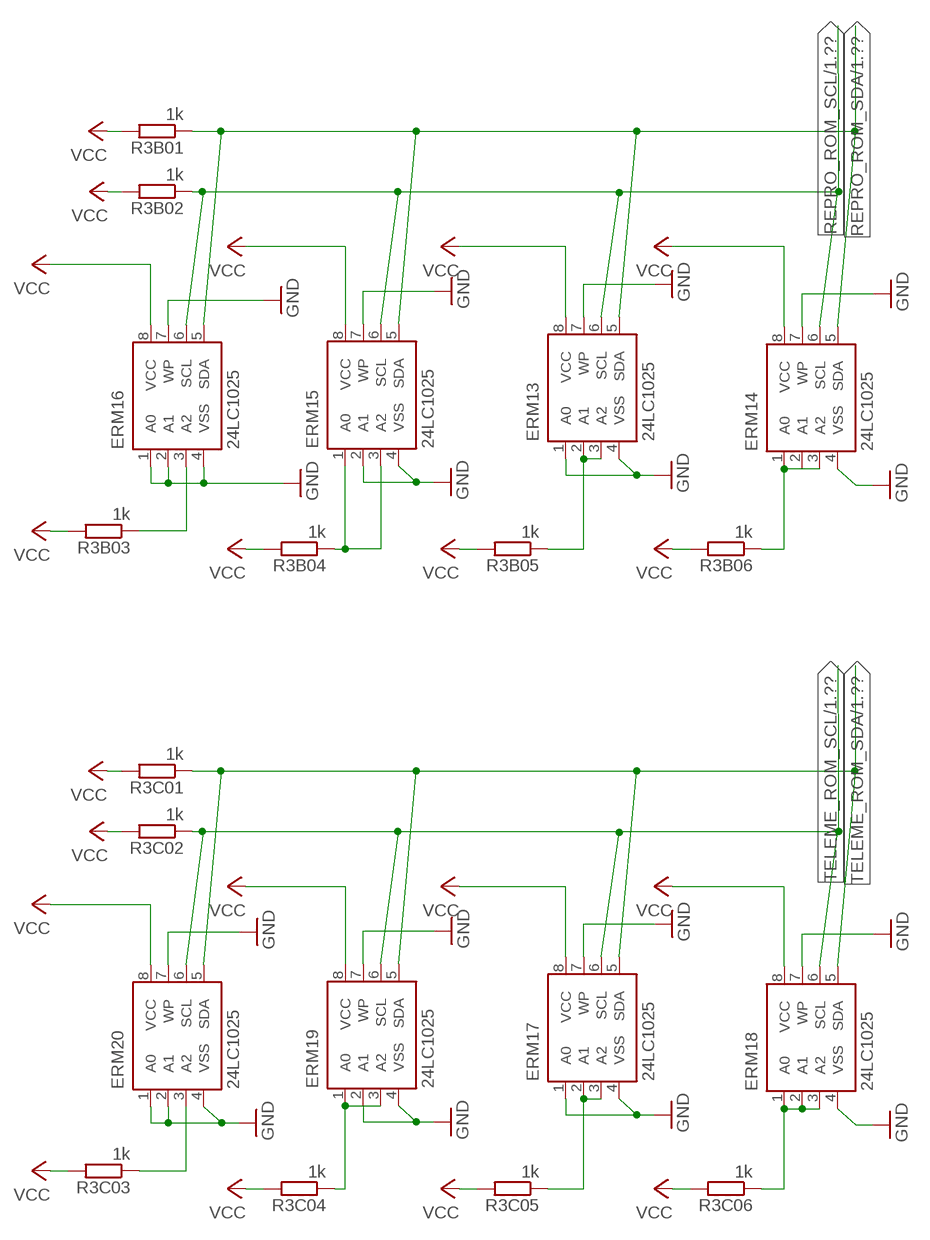
[diagram p5: schematic, sheet 5]

### Parts
ERM13  24LC1025  24LC1025-I/SM  [SOIC8]
ERM14  24LC1025  24LC1025-I/SM  [SOIC8]
ERM15  24LC1025  24LC1025-I/SM  [SOIC8]
ERM16  24LC1025  24LC1025-I/SM  [SOIC8]
ERM17  24LC1025  24LC1025-I/SM  [SOIC8]
ERM18  24LC1025  24LC1025-I/SM  [SOIC8]
ERM19  24LC1025  24LC1025-I/SM  [SOIC8]
ERM20  24LC1025  24LC1025-I/SM  [SOIC8]
R3B01  1k  R-EU_R0603  [R0603]
R3B02  1k  R-EU_R0603  [R0603]
R3B03  1k  R-EU_R0603  [R0603]
R3B04  1k  R-EU_R0603  [R0603]
R3B05  1k  R-EU_R0603  [R0603]
R3B06  1k  R-EU_R0603  [R0603]
R3C01  1k  R-EU_R0603  [R0603]
R3C02  1k  R-EU_R0603  [R0603]
R3C03  1k  R-EU_R0603  [R0603]
R3C04  1k  R-EU_R0603  [R0603]
R3C05  1k  R-EU_R0603  [R0603]
R3C06  1k  R-EU_R0603  [R0603]

### Nets
GND: ERM13.1(A0) ERM13.4(VSS) ERM13.7(WP) ERM14.4(VSS) ERM14.7(WP) ERM15.2(A1) ERM15.4(VSS) ERM15.7(WP) ERM16.1(A0) ERM16.2(A1) ERM16.4(VSS) ERM16.7(WP) ERM17.1(A0) ERM17.4(VSS) ERM17.7(WP) ERM18.4(VSS) ERM18.7(WP) ERM19.2(A1) ERM19.4(VSS) ERM19.7(WP) ERM20.1(A0) ERM20.2(A1) ERM20.4(VSS) ERM20.7(WP) ; also sheet 1,2,3,4,6
N$45: ERM16.3(A2) R3B03.1
N$46: ERM15.1(A0) ERM15.3(A2) R3B04.1
N$49: ERM13.2(A1) ERM13.3(A2) R3B05.1
N$50: ERM14.1(A0) ERM14.2(A1) ERM14.3(A2) R3B06.1
N$51: ERM20.3(A2) R3C03.1
N$57: ERM19.1(A0) ERM19.3(A2) R3C04.1
N$58: ERM17.2(A1) ERM17.3(A2) R3C05.1
N$60: ERM18.1(A0) ERM18.2(A1) ERM18.3(A2) R3C06.1
REPRO_ROM_SCL: ERM13.6(SCL) ERM14.6(SCL) ERM15.6(SCL) ERM16.6(SCL) R3B02.1 ; also sheet 1
REPRO_ROM_SDA: ERM13.5(SDA) ERM14.5(SDA) ERM15.5(SDA) ERM16.5(SDA) R3B01.1 ; also sheet 1
TELEME_ROM_SCL: ERM17.6(SCL) ERM18.6(SCL) ERM19.6(SCL) ERM20.6(SCL) R3C02.1 ; also sheet 1
TELEME_ROM_SDA: ERM17.5(SDA) ERM18.5(SDA) ERM19.5(SDA) ERM20.5(SDA) R3C01.1 ; also sheet 1
VCC: ERM13.8(VCC) ERM14.8(VCC) ERM15.8(VCC) ERM16.8(VCC) ERM17.8(VCC) ERM18.8(VCC) ERM19.8(VCC) ERM20.8(VCC) R3B01.2 R3B03.2 R3B04.2 R3B05.2 R3B06.2 R3C01.2 R3C02.2 R3C03.2 R3C04.2 R3C05.2 R3C06.2 ; also sheet 1,2,3,4,6
Unconnected: R3B02.2

## Sheet 6 of 6
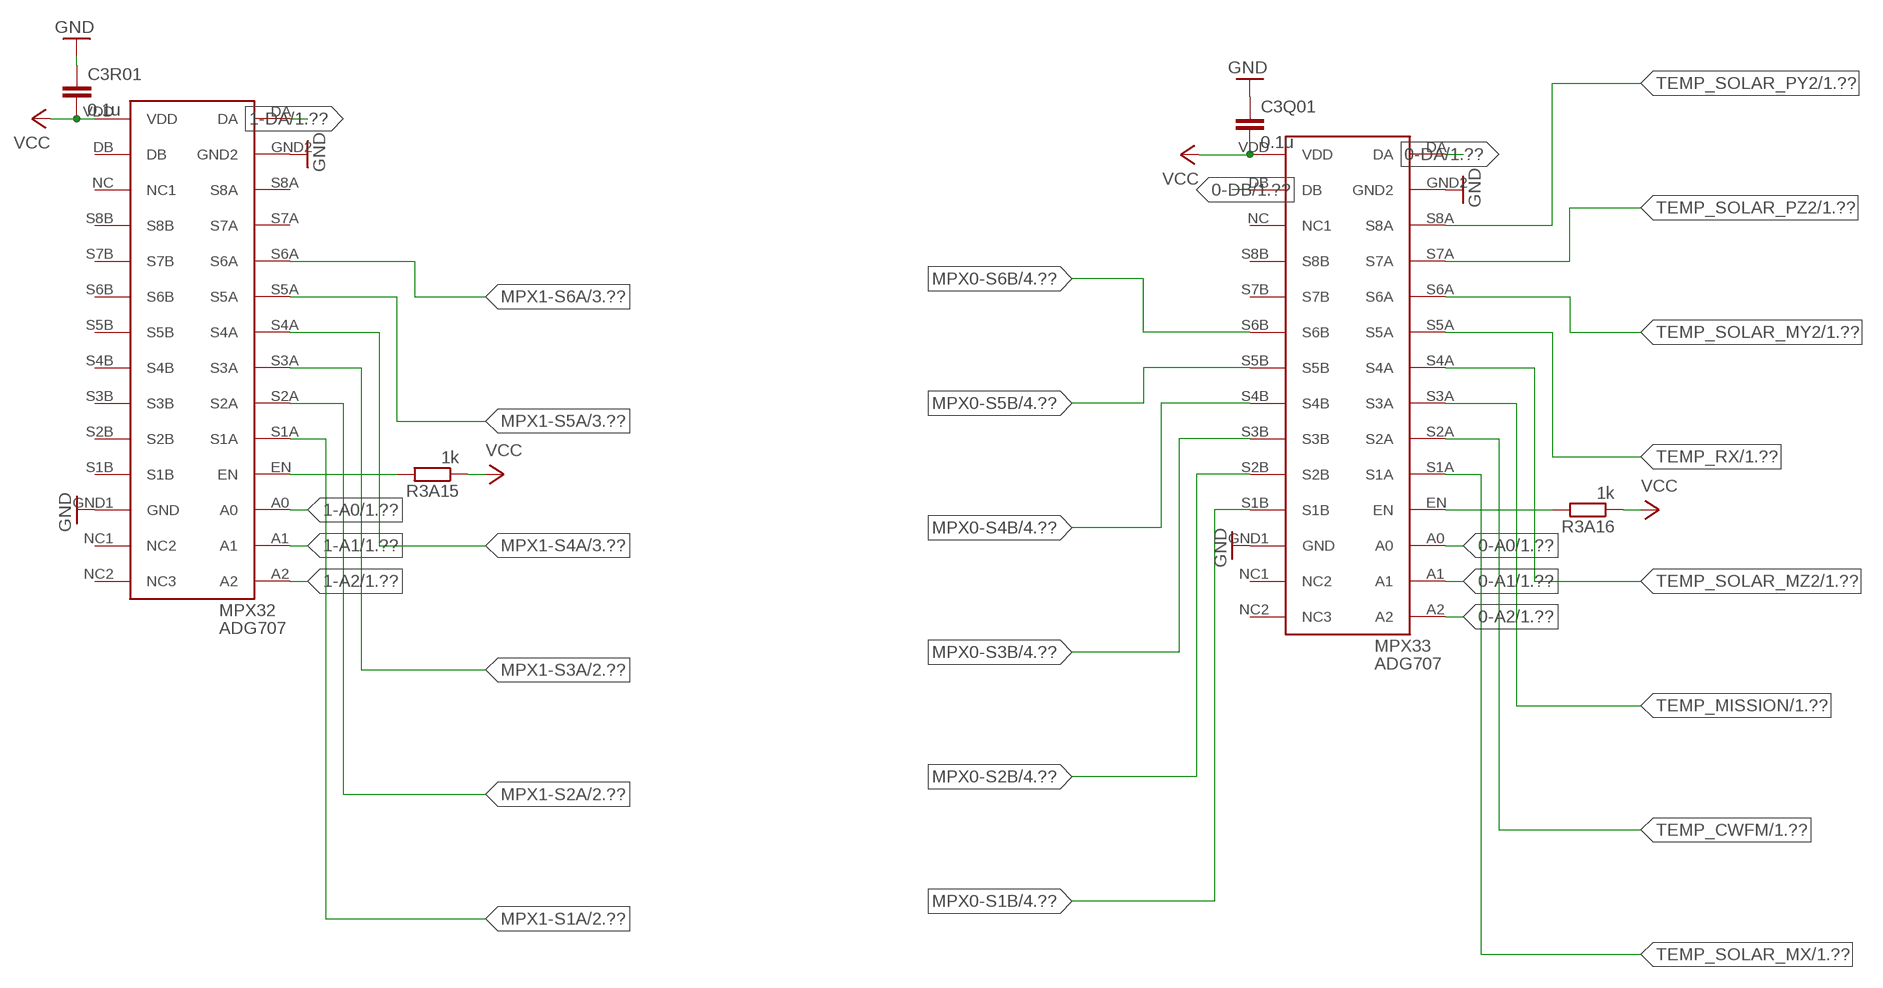
[diagram p6: schematic, sheet 6]

### Parts
C3Q01  0.1u  C-EUC0603  [C0603]
C3R01  0.1u  C-EUC0603  [C0603]
MPX32  ADG707  [ADG707]
MPX33  ADG707  [ADG707]
R3A15  1k  R-EU_R0603  [R0603]
R3A16  1k  R-EU_R0603  [R0603]

### Nets
0-A0: MPX33.A0 ; also sheet 1
0-A1: MPX33.A1 ; also sheet 1
0-A2: MPX33.A2 ; also sheet 1
0-DA: MPX33.DA ; also sheet 1
0-DB: MPX33.DB ; also sheet 1
1-A0: MPX32.A0 ; also sheet 1
1-A1: MPX32.A1 ; also sheet 1
1-A2: MPX32.A2 ; also sheet 1
1-DA: MPX32.DA ; also sheet 1
GND: C3Q01.1 C3R01.1 MPX32.GND1(GND) MPX32.GND2 MPX33.GND1(GND) MPX33.GND2 ; also sheet 1,2,3,4,5
MPX0-S1B: MPX33.S1B ; also sheet 4
MPX0-S2B: MPX33.S2B ; also sheet 4
MPX0-S3B: MPX33.S3B ; also sheet 4
MPX0-S4B: MPX33.S4B ; also sheet 4
MPX0-S5B: MPX33.S5B ; also sheet 4
MPX0-S6B: MPX33.S6B ; also sheet 4
MPX1-S1A: MPX32.S1A ; also sheet 2
MPX1-S2A: MPX32.S2A ; also sheet 2
MPX1-S3A: MPX32.S3A ; also sheet 2
MPX1-S4A: MPX32.S4A ; also sheet 3
MPX1-S5A: MPX32.S5A ; also sheet 3
MPX1-S6A: MPX32.S6A ; also sheet 3
N$36: MPX32.EN R3A15.2
N$37: MPX33.EN R3A16.2
TEMP_CWFM: MPX33.S2A ; also sheet 1
TEMP_MISSION: MPX33.S3A ; also sheet 1
TEMP_RX: MPX33.S5A ; also sheet 1
TEMP_SOLAR_MX: MPX33.S1A ; also sheet 1
TEMP_SOLAR_MY2: MPX33.S6A ; also sheet 1
TEMP_SOLAR_MZ2: MPX33.S4A ; also sheet 1
TEMP_SOLAR_PY2: MPX33.S8A ; also sheet 1
TEMP_SOLAR_PZ2: MPX33.S7A ; also sheet 1
VCC: C3Q01.2 C3R01.2 MPX32.VDD MPX33.VDD R3A15.1 R3A16.1 ; also sheet 1,2,3,4,5
Unconnected: MPX32.DB MPX32.NC1(NC2) MPX32.NC2(NC3) MPX32.NC(NC1) MPX32.S1B MPX32.S2B MPX32.S3B MPX32.S4B MPX32.S5B MPX32.S6B MPX32.S7A MPX32.S7B MPX32.S8A MPX32.S8B MPX33.NC1(NC2) MPX33.NC2(NC3) MPX33.NC(NC1) MPX33.S7B MPX33.S8B

## Library data of the parts
C3A01-C3A03 C3A06 C3A07 C3D01 C3D02 C3E01 C3E03 C3F01 C3F03 C3G01 C3G03 C3H01 C3H03 C3I01 C3I03 C3J01 C3J03 C3K01 C3K02 C3L07 C3L09 C3L11 C3M01 C3M03 C3M04 C3M06 C3N01 C3N03 C3N04 C3N06 C3O01 C3O03 C3O04 C3O06 C3P01-C3P03 C3Q01 C3R01 = rcl:C-EU: CAPACITOR, European symbol
C3A04 C3A05 C3E02 C3F02 C3G02 C3H02 C3I02 C3J02 C3L04 C3L05 C3M02 C3M05 C3N02 C3N05 C3O02 C3O05 = resistor:C-EU: CAPACITOR, European symbol
D3A01-D3A04 = 00diode2:DIODE_FM
D301 = diode:1N4004: DIODE general purpose rectifier, 1 A
ERM13-ERM20 = 24LC1025:24LC1025: 24LC1025 I2C EEPROM 24LC1025/24FC1025 1024k I2C Serial EEPROM 24LC1025-I/P: Industrial Temperature, PDIP package. 24LC1025-E/SM: Extended Temperature, SOIJ package. 24LC1025T-I/SM: Tape and Reel, Industrial Temperature, SOIJ package.
FP31-FP33 = pinhead:PINHD-1X2: PIN HEADER
G301 G302 = crm:CRM200: GYRO SENSOR for X-axis or Y-axis
G303 = crm:CRM100: GYRO SENSOR for Z-axis
H801 = h8_3069:H8-3069
HCONM = habconector20120702:XH3A-0141-A_NEW: OMRON HabConnector XH3A-0141-A 2012-07-02 OMRON HabConnector XH3B-0141-A 2012-07-02
IC301 IC314 = analog-devices:AD8541: General-Purpose CMOS Rail-to-Rail Amplifiers Source: http://www.analog.com/static/imported-files/data_sheets/AD8541_8542_8544.pdf; MPN: AD8541ARZ; OC_FARNELL: 9603859; OC_NEWARK: 31M4547
IC302-IC305 IC313 IC315-IC318 IC321-IC323 = analog-devices:AD623: Single-Supply, Rail-to-Rail, Low Cost Instrumentation Amplifier Source: http://www.analog.com/static/imported-files/data_sheets/AD623.pdf; MPN: AD623ARZ.; OC_FARNELL: 9426213; OC_NEWARK: 31M4186
IC306 = 74xx-eu:74*00: Quad 2-input NAND gate
J31-J33 J36 J39 J310 JP2 JP3 = pinhead:PINHD-1X1: PIN HEADER
JP304 = pinhead:PINHD-2X8: PIN HEADER
LD301 = led:LED: LED OSRAM: - CHIPLED LG R971, LG N971, LY N971, LG Q971, LY Q971, LO R971, LY R971 LH N974, LH R974 LS Q976, LO Q976, LY Q976 LO Q996 - Hyper CHIPLED LW Q18S LB Q993, LB Q99A, LB R99A - SideLED LS A670, LO A670, LY A670, LG A670, LP A670 LB A673, LV A673, LT A673, LW A673 LH A674 LY A675 LS A676, LA A676, LO A676, LY A676, LW A676 LS A679, LY A679, LG A679 - Hyper Micro SIDELED® LS Y876, LA Y876, LO Y876, LY Y876 LT Y87S - SmartLED LW L88C, LW L88S LB L89C, LB L89S, LG L890 LS L89K, LO L89K, LY L89K LS L896, LA L896, LO L896, LY L896 - TOPLED LS T670, LO T670, LY T670, LG T670, LP T670 LSG T670, LSP T670, LSY T670, LOP T670, LYG T670 LG T671, LOG T671, LSG T671 LB T673, LV T673, LT T673, LW T673 LH T674 LS T676, LA T676, LO T676, LY T676, LB T676, LH T676, LSB T676, LW T676 LB T67C, LV T67C, LT T67C, LS T67K, LO T67K, LY T67K, LW E67C LS E67B, LA E67B, LO E67B, LY E67B, LB E67C, LV E67C, LT E67C LW T67C LS T679, LY T679, LG T679 LS T770, LO T770, LY T770, LG T770, LP T770 LB T773, LV T773, LT T773, LW T773 LH T774 LS E675, LA E675, LY E675, LS T675 LS T776, LA T776, LO T776, LY T776, LB T776 LHGB T686 LT T68C, LB T68C - Hyper Mini TOPLED® LB M676 - Mini TOPLED Santana® LG M470 LS M47K, LO M47K, LY M47K Source: http://www.osram.convergy.de LUXEON: - LUMILED® LXK2-PW12-R00, LXK2-PW12-S00, LXK2-PW14-U00, LXK2-PW14-V00 LXK2-PM12-R00, LXK2-PM12-S00, LXK2-PM14-U00 LXK2-PE12-Q00, LXK2-PE12-R00, LXK2-PE12-S00, LXK2-PE14-T00, LXK2-PE14-U00 LXK2-PB12-K00, LXK2-PB12-L00, LXK2-PB12-M00, LXK2-PB14-N00, LXK2-PB14-P00, LXK2-PB14-Q00 LXK2-PR12-L00, LXK2-PR12-M00, LXK2-PR14-Q00, LXK2-PR14-R00 LXK2-PD12-Q00, LXK2-PD12-R00, LXK2-PD12-S00 LXK2-PH12-R00, LXK2-PH12-S00 LXK2-PL12-P00, LXK2-PL12-Q00, LXK2-PL12-R00 Source: www.luxeon.com KINGBRIGHT: KA-3528ASYC Source: www.kingbright.com
MAG301 = AMI302:AM302: AMI 302
MPX32 MPX33 = ADG707:ADG707
Q31 = crystal:CRYSTAL: CRYSTAL; OC_FARNELL: 1667008; OC_NEWARK: unknown
R3A01-R3A09 R3A10-R3A16 R3B01-R3B06 R3C01-R3C06 R3D01-R3D03 R3E01 R3E02 R3E04 R3F01 R3F02 R3F04 R3G01 R3G02 R3G04 R3H01 R3H02 R3H04 R3I01 R3I02 R3I04 R3J01 R3J02 R3J04 R3K01-R3K03 R3L01-R3L09 R3L10-R3L15 R3M01-R3M05 R3N01-R3N05 R3O01-R3O05 = rcl:R-EU_: RESISTOR, European symbol
R3A17 = resistor:R-US_: RESISTOR, American symbol
R3E03 R3F03 R3G03 R3H03 R3I03 R3J03 = mylib:R-US_: RESISTOR, American symbol
TMP301 TMP303-TMP306 = LM19_ZH:LM19_ZH: LM19 + Connector(JST XH)
TMP302 = 03LM19:LM19: LM19 (Temperature Sensor)
UA2 = max6126:MAX6126: MAX6126